# Altium schematic sheet Esquematico.SchDoc
size A2
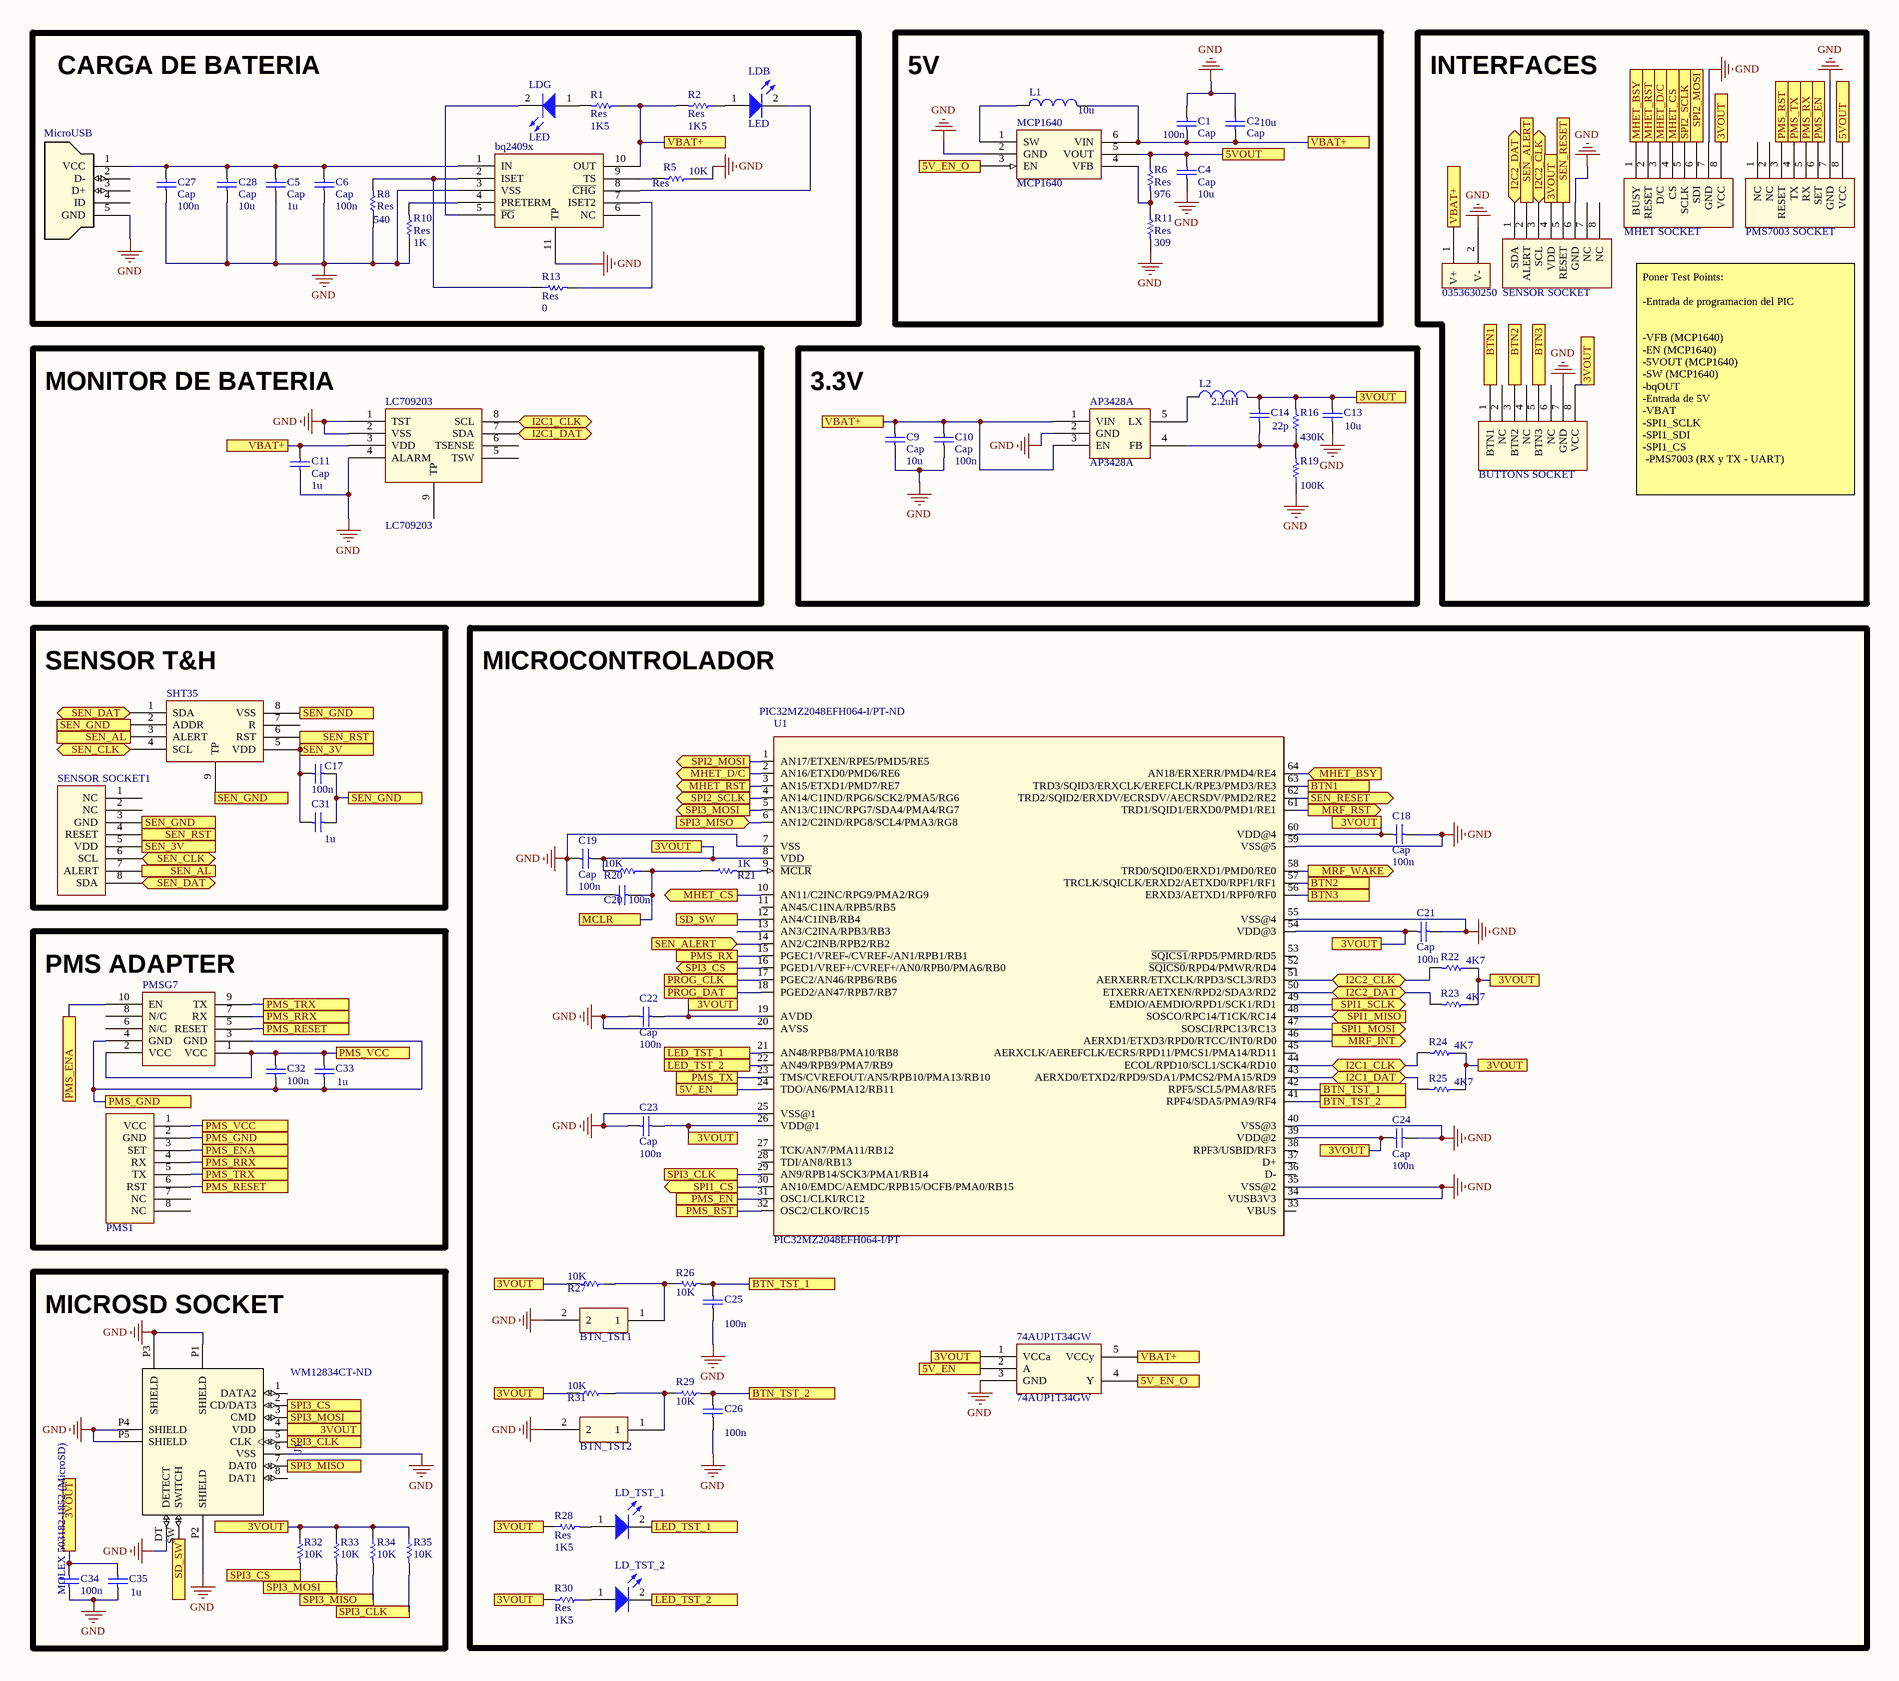
[diagram p0: Esquematico.SchDoc, left]
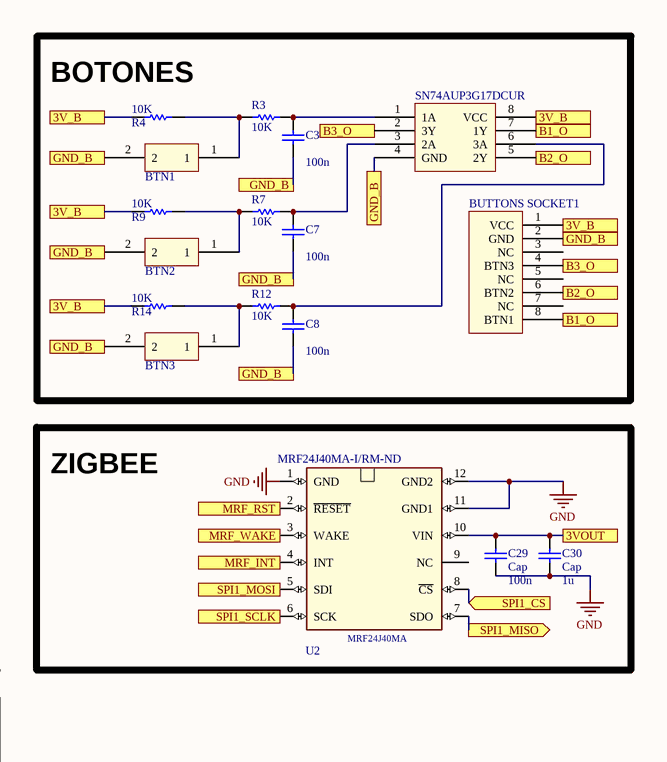
[diagram p1: Esquematico.SchDoc, right]

## Parts
74AUP1T34GW  74AUP1T34GW  [74AUP1T34GW]
0353630250  Molex 0353630250  [Molex 0353630250]  (value not drawn)
AP3428A  AP3428A  [AP3428A]
bq2409x  bq2409x  [bq2409x]  (value not drawn)
BTN1  BUTTON  [BUTTON]  (value not drawn)
BTN2  BUTTON  [BUTTON]  (value not drawn)
BTN3  BUTTON  [BUTTON]  (value not drawn)
BTN_TST1  BUTTON  [BUTTON]  (value not drawn)
BTN_TST2  BUTTON  [BUTTON]  (value not drawn)
BUTTONS_SOCKET  BUTTONS SOCKET  [S8B-ZR-SM4A-TF]  (value not drawn)
BUTTONS_SOCKET1  BUTTONS SOCKET  [S8B-ZR-SM4A-TF]  (value not drawn)
C1  Cap  value 100n  [0805 CAP]
C2  Cap  value 10u  [0805 CAP]
C3  value 100n  [0805 CAP]  (hidden comment: Cap)
C4  Cap  value 10u  [0805 CAP]
C5  Cap  value 1u  [0805 CAP]
C6  Cap  value 100n  [0805 CAP]
C7  value 100n  [0805 CAP]  (hidden comment: Cap)
C8  value 100n  [0805 CAP]  (hidden comment: Cap)
C9  Cap  value 10u  [0805 CAP]
C10  Cap  value 100n  [0805 CAP]
C11  Cap  value 1u  [0805 CAP]
C13  value 10u  [0805 CAP]  (hidden comment: Cap)
C14  value 22p  [0805 CAP]  (hidden comment: Cap)
C17  value 100n  [0805 CAP]  (hidden comment: Cap)
C18  Cap  value 100n  [0805 CAP]
C19  Cap  value 100n  [0805 CAP]
C20  value 100n  [0805 CAP]  (hidden comment: Cap)
C21  Cap  value 100n  [0805 CAP]
C22  Cap  value 100n  [0805 CAP]
C23  Cap  value 100n  [0805 CAP]
C24  Cap  value 100n  [0805 CAP]
C25  value 100n  [0805 CAP]  (hidden comment: Cap)
C26  value 100n  [0805 CAP]  (hidden comment: Cap)
C27  Cap  value 100n  [0805 CAP]
C28  Cap  value 10u  [0805 CAP]
C29  Cap  value 100n  [0805 CAP]
C30  Cap  value 1u  [0805 CAP]
C31  value 1u  [0805 CAP]  (hidden comment: Cap)
C32  value 100n  [0805 CAP]  (hidden comment: Cap)
C33  value 1u  [0805 CAP]  (hidden comment: Cap)
C34  value 100n  [0805 CAP]  (hidden comment: Cap)
C35  value 1u  [0805 CAP]  (hidden comment: Cap)
J1  MOLEX 503182-1852 (MicroSD)  Supplier Part Number 1: WM12834CT-ND  [MOLEX 503182-1852 (MicroSD)]
L1  value 10u  [INDC11030X40N]  (hidden comment: Inductor)
L2  value 2.2uH  [L2.2uH]  (hidden comment: Inductor)
LC709203  LC709203  [LC709203]
LD_TST_1  LED  [0603 LED-Green]  (value not drawn)
LD_TST_2  LED  [0603 LED-BLUE]  (value not drawn)
LDB  LED  [0603 LED-BLUE]
LDG  LED  [0603 LED-Green]
MCP1640  MCP1640  [MCP1640]
MHET_SOCKET  MHET SOCKET  [S8B-ZR-SM4A-TF]  (value not drawn)
MicroUSB  MicroUSB  [MicroUSB]  (value not drawn)
PMS1  PMS7003 SOCKET  [S8B-ZR-SM4A-TF]  (value not drawn)
PMS7003_SOCKET  PMS7003 SOCKET  [S8B-ZR-SM4A-TF]  (value not drawn)
PMSG7  PMSG7  [PMSG7]  (value not drawn)
R1  Res  value 1K5  [0805 Res]
R2  Res  value 1K5  [0805 Res]
R3  value 10K  [0805 Res]  (hidden comment: Res)
R4  value 10K  [0805 Res]  (hidden comment: Res)
R5  Res  value 10K  [0805 Res]
R6  Res  value 976  [0805 Res]
R7  value 10K  [0805 Res]  (hidden comment: Res)
R8  Res  value 540  [0805 Res]
R9  value 10K  [0805 Res]  (hidden comment: Res)
R10  Res  value 1K  [0805 Res]
R11  Res  value 309  [0805 Res]
R12  value 10K  [0805 Res]  (hidden comment: Res)
R13  Res  value 0  [0805 Res]
R14  value 10K  [0805 Res]  (hidden comment: Res)
R16  value 430K  [0805 Res]  (hidden comment: Res)
R19  value 100K  [0805 Res]  (hidden comment: Res)
R20  value 10K  [0805 Res]  (hidden comment: Res)
R21  value 1K  [0805 Res]  (hidden comment: Res)
R22  value 4K7  [0805 Res]  (hidden comment: Res)
R23  value 4K7  [0805 Res]  (hidden comment: Res)
R24  value 4K7  [0805 Res]  (hidden comment: Res)
R25  value 4K7  [0805 Res]  (hidden comment: Res)
R26  value 10K  [0805 Res]  (hidden comment: Res)
R27  value 10K  [0805 Res]  (hidden comment: Res)
R28  Res  value 1K5  [0805 Res]
R29  value 10K  [0805 Res]  (hidden comment: Res)
R30  Res  value 1K5  [0805 Res]
R31  value 10K  [0805 Res]  (hidden comment: Res)
R32  value 10K  [0805 Res]  (hidden comment: Res)
R33  value 10K  [0805 Res]  (hidden comment: Res)
R34  value 10K  [0805 Res]  (hidden comment: Res)
R35  value 10K  [0805 Res]  (hidden comment: Res)
SENSOR_SOCKET  SENSOR SOCKET  [S8B-ZR-SM4A-TF]  (value not drawn)
SENSOR_SOCKET1  SENSOR SOCKET  [S8B-ZR-SM4A-TF]  (value not drawn)
SHT35  SHT35  [SHT35]  (value not drawn)
SN74AUP3G17DCUR  (no value)  [SN74AUP3G17DCUR]
U1  PIC32MZ2048EFH064-I/PT  Supplier Part Number 1: PIC32MZ2048EFH064-I/PT-ND  [PIC32MZ2048EFH064]
U2  Supplier Part Number 1: MRF24J40MA-I/RM-ND  [MRF24J40MA]  (hidden comment: MRF24J40MA)

## Blocks framed on the sheet
CARGA DE BATERIA: bq2409x C5 C6 C27 C28 LDB LDG MicroUSB R1 R2 R5 R8 R10 R13
5V: C1 C2 C4 L1 MCP1640 R6 R11
INTERFACES: 0353630250 BUTTONS_SOCKET MHET_SOCKET PMS7003_SOCKET SENSOR_SOCKET
BOTONES: BTN1-BTN3 BUTTONS_SOCKET1 C3 C7 C8 R3 R4 R7 R9 R12 R14 SN74AUP3G17DCUR
MONITOR DE BATERIA: C11 LC709203
3.3V: AP3428A C9 C10 C13 C14 L2 R16 R19
ZIGBEE: C29 C30 U2
SENSOR T&H: C17 C31 SENSOR_SOCKET1 SHT35
MICROCONTROLADOR: 74AUP1T34GW BTN_TST1 BTN_TST2 C18-C26 LD_TST_1 LD_TST_2 R20-R31 U1
PMS ADAPTER: C32 C33 PMS1 PMSG7
MICROSD SOCKET: C34 C35 J1 R32-R35

## Ports
3V_B, 3VOUT, 5V_EN, 5V_EN_O, 5VOUT, B1_O, B2_O, B3_O, BTN1, BTN2, BTN3, BTN_TST_1, BTN_TST_2, GND_B, I2C1_CLK (bidir), I2C1_DAT (bidir), I2C2_CLK (bidir), I2C2_DAT (bidir), LED_TST_1, LED_TST_2, MCLR, MHET_BSY, MHET_BSY (in), MHET_CS (out), MHET_D/C (out), MHET_RST (out), MRF_INT (out), MRF_RST (in), MRF_RST (out), MRF_WAKE (in), MRF_WAKE (out), PMS_EN, PMS_ENA, PMS_GND, PMS_RESET, PMS_RRX, PMS_RST, PMS_RX, PMS_TRX, PMS_TX, PMS_VCC, PROG_CLK, PROG_DAT, SD_SW, SEN_3V, SEN_AL, SEN_ALERT, SEN_ALERT (in), SEN_CLK (bidir), SEN_DAT (bidir), SEN_GND, SEN_RESET, SEN_RESET (out), SEN_RST, SPI1_CS (in), SPI1_CS (out), SPI1_MISO (in), SPI1_MISO (out), SPI1_MOSI (in), SPI1_MOSI (out), SPI1_SCLK (out), SPI2_MOSI, SPI2_MOSI (out), SPI2_SCLK (out), SPI3_CLK, SPI3_CS, SPI3_CS (in), SPI3_CS (out), SPI3_MISO, SPI3_MISO (in), SPI3_MISO (out), SPI3_MOSI, SPI3_MOSI (in), SPI3_MOSI (out), VBAT+

## Nets
GND: 74AUP1T34GW.3(GND) 0353630250.2(V-) AP3428A.2(GND) bq2409x.3(VSS) bq2409x.11(TP) BTN_TST1.2 BTN_TST2.2 BUTTONS_SOCKET.7(GND) C1.1 C2.1 C4.1 C5.1 C6.1 C9.1 C10.1 C11.1 C13.1 C18.1 C19.2 C20.1 C21.1 C22.2 C23.2 C24.1 C25.2 C26.2 C27.1 C28.1 C29.1 C30.1 C34.2 C35.2 J1.6(VSS) J1.DT(DETECT) J1.P1(SHIELD) J1.P2(SHIELD) J1.P3(SHIELD) J1.P4(SHIELD) J1.P5(SHIELD) LC709203.1(TST) LC709203.2(VSS) LC709203.4(ALARM) MCP1640.2(GND) MHET_SOCKET.7(GND) MicroUSB.5(GND) PMS7003_SOCKET.7(GND) R5.1 R8.1 R10.1 R11.2 R19.1 SENSOR_SOCKET.6(GND) U1.7(VSS) U1.20(AVSS) U1.25(VSS@1) U1.34(VUSB3V3) U1.35(VSS@2) U1.40(VSS@3) U1.55(VSS@4) U1.59(VSS@5) U2.1(GND) U2.11(GND1) U2.12(GND2)
3V_B: BUTTONS_SOCKET1.1(VCC) R4.2 R9.2 R14.2 SN74AUP3G17DCUR.8(VCC) ; port 3V_B
3VOUT: 74AUP1T34GW.1(VCCa) BUTTONS_SOCKET.8(VCC) C13.2 C14.2 C18.2 C19.1 C21.2 C22.1 C23.1 C24.2 C29.2 C30.2 C34.1 C35.1 J1.4(VDD) L2.2 MHET_SOCKET.8(VCC) R16.2 R20.2 R22.1 R23.1 R24.1 R25.1 R27.2 R28.1 R30.2 R31.2 R32.1 R33.1 R34.1 R35.1 SENSOR_SOCKET.4(VDD) U1.8(VDD) U1.19(AVDD) U1.26(VDD@1) U1.39(VDD@2) U1.54(VDD@3) U1.60(VDD@4) U2.10(VIN) ; port 3VOUT
5V_EN: 74AUP1T34GW.2(A) U1.24(TDO/AN6/PMA12/RB11) ; port 5V_EN
5V_EN_O: 74AUP1T34GW.4(Y) MCP1640.3(EN) ; port 5V_EN_O
5VOUT: C4.2 MCP1640.5(VOUT) PMS7003_SOCKET.8(VCC) R6.1 ; port 5VOUT
B1_O: BUTTONS_SOCKET1.8(BTN1) SN74AUP3G17DCUR.7(1Y) ; port B1_O
B2_O: BUTTONS_SOCKET1.6(BTN2) SN74AUP3G17DCUR.5(2Y) ; port B2_O
B3_O: BUTTONS_SOCKET1.4(BTN3) SN74AUP3G17DCUR.2(3Y) ; port B3_O
BTN1: BUTTONS_SOCKET.1(BTN1) U1.63(TRD3/SQID3/ERXCLK/EREFCLK/RPE3/PMD3/RE3) ; port BTN1
BTN2: BUTTONS_SOCKET.3(BTN2) U1.57(TRCLK/SQICLK/ERXD2/AETXD0/RPF1/RF1) ; port BTN2
BTN3: BUTTONS_SOCKET.5(BTN3) U1.56(ERXD3/AETXD1/RPF0/RF0) ; port BTN3
BTN_TST_1: C25.1 R26.2 U1.42(RPF5/SCL5/PMA8/RF5) ; port BTN_TST_1
BTN_TST_2: C26.1 R29.2 U1.41(RPF4/SDA5/PMA9/RF4) ; port BTN_TST_2
GND_B: BTN1.2 BTN2.2 BTN3.2 BUTTONS_SOCKET1.2(GND) C3.2 C7.2 C8.2 SN74AUP3G17DCUR.4(GND) ; port GND_B
I2C1_CLK: LC709203.8(SCL) R24.2 U1.44(ECOL/RPD10/SCL1/SCK4/RD10) ; port I2C1_CLK
I2C1_DAT: LC709203.7(SDA) R25.2 U1.43(AERXD0/ETXD2/RPD9/SDA1/PMCS2/PMA15/RD9) ; port I2C1_DAT
I2C2_CLK: R22.2 SENSOR_SOCKET.3(SCL) U1.51(AERXERR/ETXCLK/RPD3/SCL3/RD3) ; port I2C2_CLK
I2C2_DAT: R23.2 SENSOR_SOCKET.1(SDA) U1.50(ETXERR/AETXEN/RPD2/SDA3/RD2) ; port I2C2_DAT
LED_TST_1: LD_TST_1.2(C) U1.21(AN48/RPB8/PMA10/RB8) ; port LED_TST_1
LED_TST_2: LD_TST_2.2(C) U1.22(AN49/RPB9/PMA7/RB9) ; port LED_TST_2
MCLR: C20.2 R20.1 R21.1 ; port MCLR
MHET_BSY: MHET_SOCKET.1(BUSY) U1.64(AN18/ERXERR/PMD4/RE4) ; port MHET_BSY
MHET_CS: MHET_SOCKET.4(CS) U1.10(AN11/C2INC/RPG9/PMA2/RG9) ; port MHET_CS
MHET_D/C: MHET_SOCKET.3(D/C) U1.2(AN16/ETXD0/PMD6/RE6) ; port MHET_D/C
MHET_RST: MHET_SOCKET.2(RESET) U1.3(AN15/ETXD1/PMD7/RE7) ; port MHET_RST
MRF_INT: U1.46(AERXD1/ETXD3/RPD0/RTCC/INT0/RD0) U2.4(INT) ; port MRF_INT
MRF_RST: U1.61(TRD1/SQID1/ERXD0/PMD1/RE1) U2.2(~{RESET}) ; port MRF_RST
MRF_WAKE: U1.58(TRD0/SQID0/ERXD1/PMD0/RE0) U2.3(WAKE) ; port MRF_WAKE
PMS_EN: PMS7003_SOCKET.6(SET) U1.31(OSC1/CLKI/RC12) ; port PMS_EN
PMS_ENA: PMS1.3(SET) PMSG7.10(EN) ; port PMS_ENA
PMS_GND: C32.2 C33.2 PMS1.2(GND) PMSG7.3(GND) PMSG7.4(GND) ; port PMS_GND
PMS_RESET: PMS1.6(RST) PMSG7.5(RESET) ; port PMS_RESET
PMS_RRX: PMS1.4(RX) PMSG7.7(RX) ; port PMS_RRX
PMS_RST: PMS7003_SOCKET.3(RESET) U1.32(OSC2/CLKO/RC15) ; port PMS_RST
PMS_RX: PMS7003_SOCKET.5(RX) U1.15(PGEC1/VREF-/CVREF-/AN1/RPB1/RB1) ; port PMS_RX
PMS_TRX: PMS1.5(TX) PMSG7.9(TX) ; port PMS_TRX
PMS_TX: PMS7003_SOCKET.4(TX) U1.23(TMS/CVREFOUT/AN5/RPB10/PMA13/RB10) ; port PMS_TX
PMS_VCC: C32.1 C33.1 PMS1.1(VCC) PMSG7.1(VCC) PMSG7.2(VCC) ; port PMS_VCC
PROG_CLK: U1.17(PGEC2/AN46/RPB6/RB6) ; port PROG_CLK
PROG_DAT: U1.18(PGED2/AN47/RPB7/RB7) ; port PROG_DAT
SD_SW: J1.SW(SWITCH) U1.12(AN4/C1INB/RB4) ; port SD_SW
SEN_3V: C17.2 C31.2 SENSOR_SOCKET1.5(VDD) SHT35.5(VDD) ; port SEN_3V
SEN_AL: SENSOR_SOCKET1.7(ALERT) SHT35.3(ALERT) ; port SEN_AL
SEN_ALERT: SENSOR_SOCKET.2(ALERT) U1.14(AN2/C2INB/RPB2/RB2) ; port SEN_ALERT
SEN_CLK: SENSOR_SOCKET1.6(SCL) SHT35.4(SCL) ; port SEN_CLK
SEN_DAT: SENSOR_SOCKET1.8(SDA) SHT35.1(SDA) ; port SEN_DAT
SEN_GND: C17.1 C31.1 SENSOR_SOCKET1.3(GND) SHT35.2(ADDR) SHT35.8(VSS) SHT35.9(TP) ; port SEN_GND
SEN_RESET: SENSOR_SOCKET.5(RESET) U1.62(TRD2/SQID2/ERXDV/ECRSDV/AECRSDV/PMD2/RE2) ; port SEN_RESET
SEN_RST: SENSOR_SOCKET1.4(RESET) SHT35.6(RST) ; port SEN_RST
SPI1_CS: U1.30(AN10/EMDC/AEMDC/RPB15/OCFB/PMA0/RB15) U2.8(~{CS}) ; port SPI1_CS
SPI1_MISO: U1.48(SOSCO/RPC14/T1CK/RC14) U2.7(SDO) ; port SPI1_MISO
SPI1_MOSI: U1.47(SOSCI/RPC13/RC13) U2.5(SDI) ; port SPI1_MOSI
SPI1_SCLK: U1.49(EMDIO/AEMDIO/RPD1/SCK1/RD1) U2.6(SCK) ; port SPI1_SCLK
SPI2_MOSI: MHET_SOCKET.6(SDI) U1.1(AN17/ETXEN/RPE5/PMD5/RE5) ; port SPI2_MOSI
SPI2_SCLK: MHET_SOCKET.5(SCLK) U1.4(AN14/C1IND/RPG6/SCK2/PMA5/RG6) ; port SPI2_SCLK
SPI3_CLK: J1.5(CLK) R35.2 U1.29(AN9/RPB14/SCK3/PMA1/RB14) ; port SPI3_CLK
SPI3_CS: J1.2(CD/DAT3) R32.2 U1.16(PGED1/VREF+/CVREF+/AN0/RPB0/PMA6/RB0) ; port SPI3_CS
SPI3_MISO: J1.7(DAT0) R34.2 U1.6(AN12/C2IND/RPG8/SCL4/PMA3/RG8) ; port SPI3_MISO
SPI3_MOSI: J1.3(CMD) R33.2 U1.5(AN13/C1INC/RPG7/SDA4/PMA4/RG7) ; port SPI3_MOSI
VBAT+: 74AUP1T34GW.5(VCCy) 0353630250.1(V+) AP3428A.1(VIN) AP3428A.3(EN) bq2409x.10(OUT) C1.2 C2.2 C9.2 C10.2 C11.2 L1.2 LC709203.3(VDD) MCP1640.6(VIN) R1.1 R2.2 ; port VBAT+
NetAP3428A_4: AP3428A.4(FB) C14.1 R16.1 R19.2
NetAP3428A_5: AP3428A.5(LX) L2.1
Netbq2409x_1: bq2409x.1(IN) C5.2 C6.2 C27.2 C28.2 MicroUSB.1(VCC)
Netbq2409x_2: bq2409x.2(ISET) R8.2 R13.1
Netbq2409x_4: bq2409x.4(PRETERM) R10.2
Netbq2409x_5: bq2409x.5(~{PG}) LDG.2(C)
Netbq2409x_7: bq2409x.7(ISET2) R13.2
Netbq2409x_8: bq2409x.8(~{CHG}) LDB.2(C)
Netbq2409x_9: bq2409x.9(TS) R5.2
NetBTN1_1: BTN1.1 R3.1 R4.1
NetBTN2_1: BTN2.1 R7.1 R9.1
NetBTN3_1: BTN3.1 R12.1 R14.1
NetBTN_TST1_1: BTN_TST1.1 R26.1 R27.1
NetBTN_TST2_1: BTN_TST2.1 R29.1 R31.1
NetC3_1: C3.1 R3.2 SN74AUP3G17DCUR.1(1A)
NetC7_1: C7.1 R7.2 SN74AUP3G17DCUR.3(2A)
NetC8_1: C8.1 R12.2 SN74AUP3G17DCUR.6(3A)
NetL1_1: L1.1 MCP1640.1(SW)
NetLD_TST_1_1: LD_TST_1.1(A) R28.2
NetLD_TST_2_1: LD_TST_2.1(A) R30.1
NetLDB_1: LDB.1(A) R2.1
NetLDG_1: LDG.1(A) R1.2
NetMCP1640_4: MCP1640.4(VFB) R6.2 R11.1
NetR21_2: R21.2 U1.9(~{MCLR})

Not connected (* = marked no-connect by the designer): bq2409x 6(NC); BUTTONS_SOCKET 2(NC) 4(NC) 6(NC); BUTTONS_SOCKET1 3(NC) 5(NC) 7(NC); J1 1(DATA2) 8(DAT1); LC709203 5(TSW) 6(TSENSE) 9(TP); MicroUSB 2(D-) 3(D+) 4(ID); PMS1 7(NC) 8(NC); PMS7003_SOCKET 1(NC) 2(NC); PMSG7 6(N/C) 8(N/C); SENSOR_SOCKET 7(NC) 8(NC); SENSOR_SOCKET1 1(NC) 2(NC); SHT35 7(R); U1 11(AN45/C1INA/RPB5/RB5) 13(AN3/C2INA/RPB3/RB3) 27(TCK/AN7/PMA11/RB12) 28(TDI/AN8/RB13) 33(VBUS) 36(D-) 37(D+) 38(RPF3/USBID/RF3) 45(AERXCLK/AEREFCLK/ECRS/RPD11/PMCS1/PMA14/RD11) 52(~{SQICS0}/RPD4/PMWR/RD4) 53(~{SQICS1}/RPD5/PMRD/RD5); U2 9(NC)

## Notes on the sheet
- Poner Test Points:
  -Entrada de programacion del PIC
  -VFB (MCP1640)
  -EN (MCP1640)
  -5VOUT (MCP1640)
  -SW (MCP1640)
  -bqOUT
  -Entrada de 5V
  -VBAT
  -SPI1_SCLK
  -SPI1_SDI
  -SPI1_CS
  -PMS7003 (RX y TX - UART)

## Library data of the parts
J1 = MOLEX 503182-1852 (MicroSD): MICRO SD NORMAL ULTRALOWPRO8CKTE; MP: 5031821852; Digi-Key_Purchase_URL: https://www.digikey.es/product-detail/en/molex/5031821852/WM12834CT-ND/5823232?utm_source=snapeda&utm_medium=aggregator&utm_campaign=symbol; Package: None; SnapEDA_Link: https://www.snapeda.com/parts/5031821852/Molex/view-part/?ref=snap; MF: Molex; Digi-Key_Part_Number: WM12834CT-ND; Value: *; Supplier 1: Digi-Key
L1 L2 = Inductor: Code_IEC: 1005; Published: 8-Jun-2000; LatestRevisionDate: 29-May-2009; LatestRevisionNote: IPC-7351 Footprint Added.; PackageReference: 0402-A; Publisher: Altium Limited; PackageDescription: Chip Inductor; Code_JEITA: 0402; Supplier 1: Digi-Key
  L1: Supplier Part Number 1: 732-3389-1-ND
  L2: Supplier Part Number 1: 308-1569-1-ND
SN74AUP3G17DCUR = SN74AUP3G17DCUR: Supplier 1: Digi-Key; Supplier Part Number 1: 296-25596-1-ND
U1 = PIC32MZ2048EFH064-I/PT: PIC32MZ Series 2 MB Flash 512 kB RAM 200 MHz 32-Bit Microcontroller - TQFP-64; MF: Microchip; SnapEDA_Link: https://www.snapeda.com/parts/PIC32MZ2048EFH064-I/PT/Microchip/view-part/?ref=snap; Package: TQFP-64 Microchip; Availability: Unavailable; Price: None; MP: PIC32MZ2048EFH064-I/PT; Value: *; Supplier 1: Digi-Key
U2 = MRF24J40MA: Wireless Transceiver Module; MF: Microchip; MP: MRF24J40MA; Package: Module Microchip; Digi-Key_Purchase_URL: https://www.digikey.es/product-detail/en/microchip-technology/MRF24J40MAT-I-RM/MRF24J40MAT-I-RMTR-ND/2002555?utm_source=snapeda&utm_medium=aggregator&utm_campaign=symbol; Digi-Key_Part_Number: MRF24J40MAT-I/RMTR-ND; SnapEDA_Link: https://www.snapeda.com/parts/MRF24J40MA/Microchip/view-part/?ref=snap; Value: *; Supplier 1: Digi-Key
74AUP1T34GW = 74AUP1T34GW: Supplier 1: Digi-Key; Supplier Part Number 1: 1727-6030-1-ND
0353630250 = Molex 0353630250: Supplier 1: Digi-Key; Supplier Part Number 1: WM12220-ND
AP3428A = AP3428A: Supplier 1: Digi-Key; Supplier Part Number 1: AP3428AKTTR-G1DICT-ND
bq2409x = bq2409x: Supplier 1: Digi-Key; Supplier Part Number 1: 296-38875-1-ND
BTN1-BTN3 BTN_TST1 BTN_TST2 = BUTTON: Supplier 1: Digi-Key; Supplier Part Number 1: CKN10779CT-ND
BUTTONS_SOCKET BUTTONS_SOCKET1 = BUTTONS SOCKET: Supplier 1: Digi-Key; Supplier Part Number 1: 455-1698-1-ND
C1-C11 C13 C14 C17-C35 = Cap: Supplier 1: Digi-Key
  C1 C3 C6-C8 C10 C17-C27 C29 C32 C34: Supplier Part Number 1: 399-1169-1-ND
  C2 C4 C9 C13 C28: Supplier Part Number 1: 490-14661-1-ND
  C5 C11 C30 C31 C33 C35: Supplier Part Number 1: 490-8043-1-ND
  C14: Supplier Part Number 1: 399-1113-1-ND
LC709203 = LC709203: Supplier 1: Digi-Key; Supplier Part Number 1: LC709203FQH-01TWGOSCT-ND
LD_TST_1 LD_TST_2 LDB LDG = LED: Supplier 1: Digi-Key
  LD_TST_1 LDG: Supplier Part Number 1: 160-1446-1-ND
  LD_TST_2 LDB: Supplier Part Number 1: 160-1827-1-ND
MCP1640 = MCP1640: Supplier 1: Digi-Key; Supplier Part Number 1: MCP1640T-I/CHYCT-ND
MHET_SOCKET = MHET SOCKET: Supplier 1: Digi-Key; Supplier Part Number 1: 455-1698-1-ND
MicroUSB = MicroUSB: Supplier 1: Digi-Key; Supplier Part Number 1: 609-4050-1-ND
PMS1 PMS7003_SOCKET = PMS7003 SOCKET: Supplier 1: Digi-Key; Supplier Part Number 1: 455-1698-1-ND
PMSG7 = PMSG7: Supplier 1: Digi-Key; Supplier Part Number 1: 609-3754-ND
R1-R14 R16 R19-R35 = Res: Supplier 1: Digi-Key
  R1 R2 R28 R30: Supplier Part Number 1: RNCP0805FTD1K50CT-ND
  R3-R5 R7 R9 R12 R14 R20 R26 R27 R29 R31-R35: Supplier Part Number 1: RNCF0805DTE10K0CT-ND
  R6: Supplier Part Number 1: P976DACT-ND
  R8: Supplier Part Number 1: P549DACT-ND
  R10 R21: Supplier Part Number 1: RNCP0805FTD1K00CT-ND
  R11: Supplier Part Number 1: A110494CT-ND
  R13: Supplier Part Number 1: RMCF0805ZT0R00CT-ND
  R16: Supplier Part Number 1: P430KDACT-ND
  R19: Supplier Part Number 1: TNP100KABCT-ND
  R22-R25: Supplier Part Number 1: A130138CT-ND
SENSOR_SOCKET SENSOR_SOCKET1 = SENSOR SOCKET: Supplier 1: Digi-Key; Supplier Part Number 1: 455-1698-1-ND
SHT35 = SHT35: Supplier 1: Digi-Key; Supplier Part Number 1: 1649-1062-1-ND